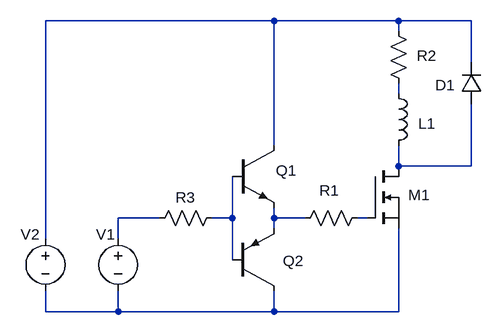
[diagram p0: schematic circuit_1.asc]
circuit_1.asc, the LTspice schematic file:
Version 4
SHEET 1 880 680
WIRE 272 -96 -80 -96
WIRE 464 -96 272 -96
WIRE 576 -96 464 -96
WIRE 464 -80 464 -96
WIRE 576 -32 576 -96
WIRE 464 16 464 0
WIRE 272 96 272 -96
WIRE 464 128 464 96
WIRE 576 128 576 32
WIRE 576 128 464 128
WIRE 96 208 32 208
WIRE 208 208 208 144
WIRE 208 208 176 208
WIRE 272 208 272 192
WIRE 320 208 272 208
WIRE 416 208 400 208
WIRE 272 224 272 208
WIRE -80 240 -80 -96
WIRE 32 240 32 208
WIRE 208 272 208 208
WIRE -80 352 -80 320
WIRE 32 352 32 320
WIRE 32 352 -80 352
WIRE 272 352 272 320
WIRE 272 352 32 352
WIRE 464 352 464 224
WIRE 464 352 272 352
SYMBOL voltage 32 224 R0
WINDOW 0 -34 9 Left 2
SYMATTR InstName V1
SYMATTR Value ""
SYMBOL pnp 208 320 M180
WINDOW 0 78 46 Left 2
SYMATTR InstName Q2
SYMATTR Value ""
SYMBOL npn 208 96 R0
WINDOW 0 67 39 Left 2
SYMATTR InstName Q1
SYMATTR Value ""
SYMBOL res 192 192 R90
WINDOW 0 0 56 VBottom 2
WINDOW 3 32 56 VTop 2
SYMATTR InstName R3
SYMATTR Value ""
SYMBOL res 416 192 R90
WINDOW 0 -11 59 VBottom 2
WINDOW 3 32 56 VTop 2
SYMATTR InstName R1
SYMATTR Value ""
SYMBOL nmos 416 128 R0
WINDOW 0 63 44 Left 2
SYMATTR InstName M1
SYMATTR Value ""
SYMBOL ind 448 0 R0
WINDOW 0 46 62 Left 2
SYMATTR InstName L1
SYMATTR Value ""
SYMBOL res 448 -96 R0
WINDOW 0 44 54 Left 2
SYMATTR InstName R2
SYMATTR Value ""
SYMBOL diode 592 32 R180
WINDOW 0 41 29 Left 2
WINDOW 3 24 0 Left 2
SYMATTR InstName D1
SYMATTR Value ""
SYMBOL voltage -80 224 R0
WINDOW 0 -38 9 Left 2
SYMATTR InstName V2
SYMATTR Value ""

The netlist it stands for:
* circuit_1.asc
V1 N004 N008
Q2 N008 N005 N006 0
Q1 N001 N005 N006 0
R3 N005 N004
R1 N007 N006
M1 N003 N007 N008 N008
L1 N002 N003
R2 N001 N002
D1 N003 N001
V2 N001 N008
.model D D
.lib standard.dio
.model NPN NPN
.model PNP PNP
.lib standard.bjt
.model NMOS NMOS
.model PMOS PMOS
.lib standard.mos
.backanno
.end